# Altium schematic sheet Sheet1.SchDoc
size A3
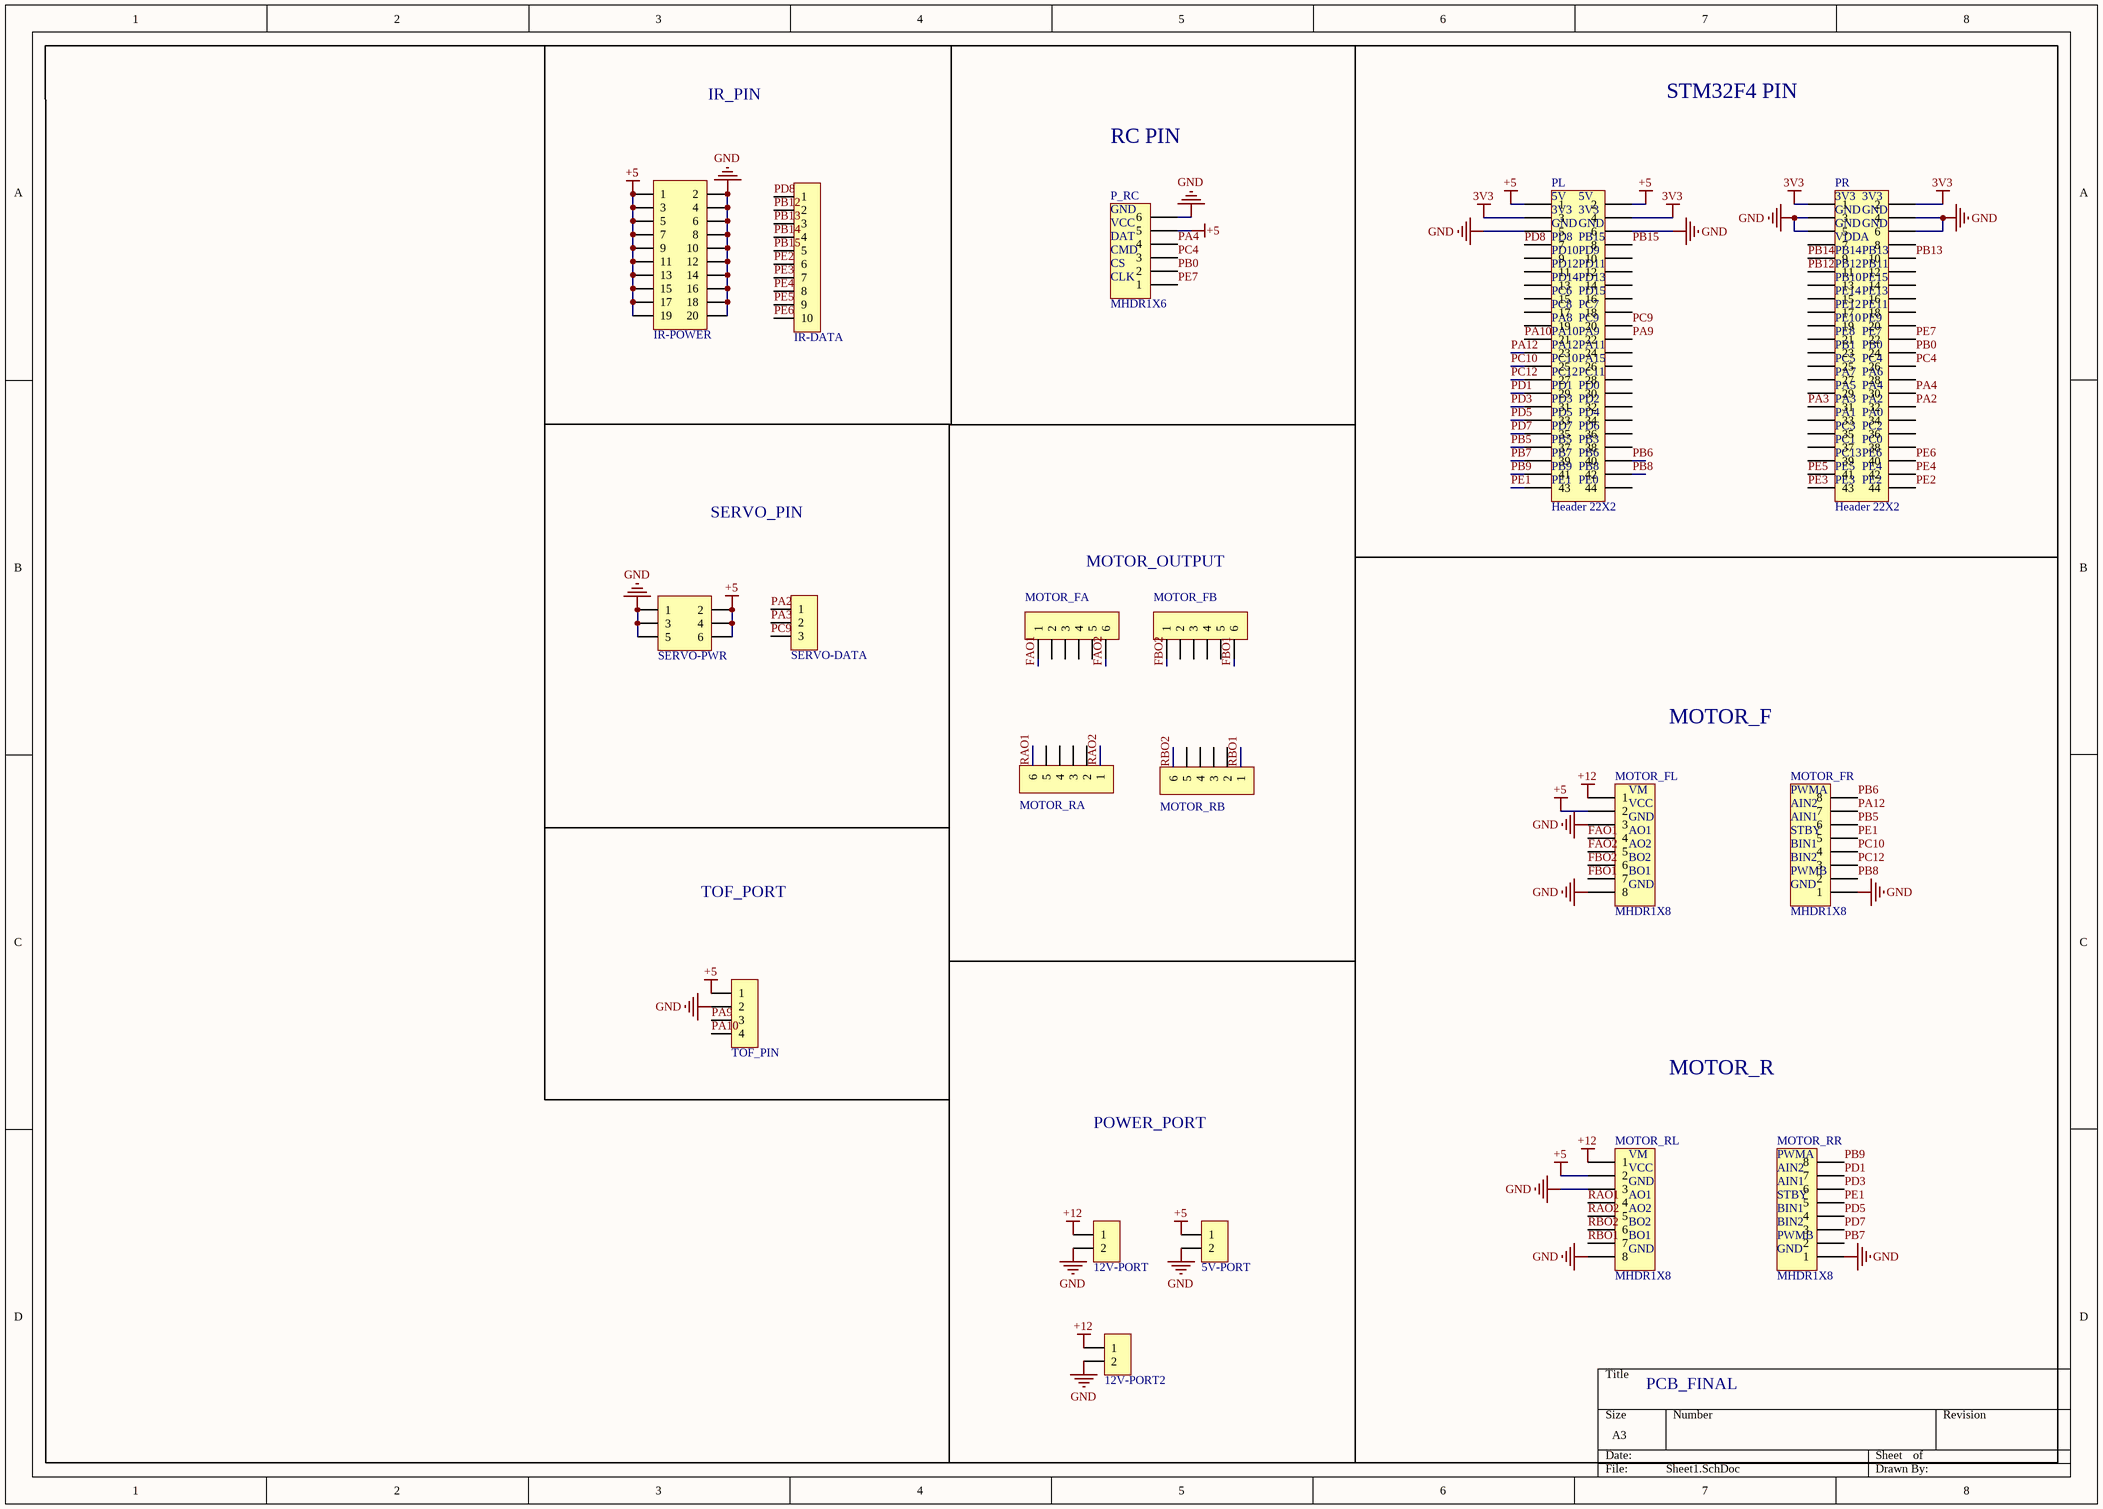
[diagram p0: Sheet1.SchDoc]

## Parts
5V-PORT  HDR-1X2  [KF301-5.0-2P]  (value not drawn)
12V-PORT  HDR-1X2  [KF301-5.0-2P]  (value not drawn)
12V-PORT2  HDR-1X2  [KF301-5.0-2P]  (value not drawn)
IR-DATA  HDR-1X10  [HDR2.54-LI-10P]  (value not drawn)
IR-POWER  Header 2X10  [HDR2.54-LI-2x10P]  (value not drawn)
MOTOR_FA  HDR-1X6  [PH2.0-LI-6P]  (value not drawn)
MOTOR_FB  HDR-1X6  [PH2.0-LI-6P]  (value not drawn)
MOTOR_FL  MHDR1X8  [HDR2.54-M-LI-8P]
MOTOR_FR  MHDR1X8  [HDR2.54-M-LI-8P]
MOTOR_RA  HDR-1X6  [PH2.0-LI-6P]  (value not drawn)
MOTOR_RB  HDR-1X6  [PH2.0-LI-6P]  (value not drawn)
MOTOR_RL  MHDR1X8  [HDR2.54-M-LI-8P]
MOTOR_RR  MHDR1X8  [HDR2.54-M-LI-8P]
P_RC  MHDR1X6  [HDR2.54-M-LI-6P]
PL  Header 22X2  [P_M_2x22P]
PR  Header 22X2  [P_M_2x22P]
SERVO-DATA  HDR-1X3  [HDR2.54-LI-3P]  (value not drawn)
SERVO-PWR  Header3X2  [HDR2.54-LI-2x3P]  (value not drawn)
TOF_PIN  HDR-1X4  [HDR2.54-LI-4P]  (value not drawn)

## Nets
3V3: PL.3 PL.4 PR.1 PR.2
+5: 5V-PORT.1 IR-POWER.1 IR-POWER.3 IR-POWER.5 IR-POWER.7 IR-POWER.9 IR-POWER.11 IR-POWER.13 IR-POWER.15 IR-POWER.17 IR-POWER.19 MOTOR_FL.2 MOTOR_RL.2 P_RC.5 PL.1 PL.2 SERVO-PWR.2 SERVO-PWR.4 SERVO-PWR.6 TOF_PIN.1
+12: 12V-PORT.1 12V-PORT2.1 MOTOR_FL.1 MOTOR_RL.1
GND: 5V-PORT.2 12V-PORT.2 12V-PORT2.2 IR-POWER.2 IR-POWER.4 IR-POWER.6 IR-POWER.8 IR-POWER.10 IR-POWER.12 IR-POWER.14 IR-POWER.16 IR-POWER.18 IR-POWER.20 MOTOR_FL.3 MOTOR_FL.8 MOTOR_FR.1 MOTOR_RL.3 MOTOR_RL.8 MOTOR_RR.1 P_RC.6 PL.5 PL.6 PR.3 PR.4 PR.5 PR.6 SERVO-PWR.1 SERVO-PWR.3 SERVO-PWR.5 TOF_PIN.2
FAO1: MOTOR_FA.1 MOTOR_FL.4
FAO2: MOTOR_FA.6 MOTOR_FL.5
FBO1: MOTOR_FB.6 MOTOR_FL.7
FBO2: MOTOR_FB.1 MOTOR_FL.6
PA2: PR.32 SERVO-DATA.1
PA3: PR.31 SERVO-DATA.2
PA4: P_RC.4 PR.30
PA9: PL.22 TOF_PIN.3
PA10: PL.21 TOF_PIN.4
PA12: MOTOR_FR.7 PL.23
PB0: P_RC.2 PR.24
PB5: MOTOR_FR.6 PL.37
PB6: MOTOR_FR.8 PL.40
PB7: MOTOR_RR.2 PL.39
PB8: MOTOR_FR.2 PL.42
PB9: MOTOR_RR.8 PL.41
PB12: IR-DATA.2 PR.11
PB13: IR-DATA.3 PR.10
PB14: IR-DATA.4 PR.9
PB15: IR-DATA.5 PL.8
PC4: P_RC.3 PR.26
PC9: PL.20 SERVO-DATA.3
PC10: MOTOR_FR.4 PL.25
PC12: MOTOR_FR.3 PL.27
PD1: MOTOR_RR.7 PL.29
PD3: MOTOR_RR.6 PL.31
PD5: MOTOR_RR.4 PL.33
PD7: MOTOR_RR.3 PL.35
PD8: IR-DATA.1 PL.7
PE1: MOTOR_FR.5 MOTOR_RR.5 PL.43
PE2: IR-DATA.6 PR.44
PE3: IR-DATA.7 PR.43
PE4: IR-DATA.8 PR.42
PE5: IR-DATA.9 PR.41
PE6: IR-DATA.10 PR.40
PE7: P_RC.1 PR.22
RAO1: MOTOR_RA.6 MOTOR_RL.4
RAO2: MOTOR_RA.1 MOTOR_RL.5
RBO1: MOTOR_RB.1 MOTOR_RL.7
RBO2: MOTOR_RB.6 MOTOR_RL.6

Not connected (* = marked no-connect by the designer): MOTOR_FA 2 3 4 5; MOTOR_FB 2 3 4 5; MOTOR_RA 2 3 4 5; MOTOR_RB 2 3 4 5; PL 9 10 11 12 13 14 15 16 17 18 19 24 26 28 30 32 34 36 38 44; PR 7 8 12 13 14 15 16 17 18 19 20 21 23 25 27 28 29 33 34 35 36 37 38 39

## Notes on the sheet
- IR_PIN
- STM32F4 PIN
- RC PIN
- (near P_RC) GND
- (near P_RC) VCC
- (near P_RC) DAT
- (near PL) 5V
- (near PL) 3V3
- (near PL) GND
- (near PL) PD8
- (near PL) PB15
- (near PR) VDDA
- (near PR) GND
- (near PR) 3V3
- (near P_RC) CMD
- (near P_RC) CS
- (near P_RC) CLK
- (near PL) PD10
- (near PL) PD12
- (near PL) PD14
- (near PL) PC6
- (near PL) PC8
- (near PL) PD9
- (near PL) PD11
- (near PL) PD13
- (near PL) PD15
- (near PL) PC7
- (near PR) PB10
- (near PR) PB12
- (near PR) PB14
- (near PR) PE12
- (near PR) PE14
- (near PR) PB11
- (near PR) PB13
- (near PR) PE11
- (near PR) PE13
- (near PR) PE15
- (near PL) PC10
- (near PL) PC12
- (near PL) PA8
- (near PL) PA10
- (near PL) PA12
- (near PL) PC9
- (near PL) PC11
- (near PL) PA9
- (near PL) PA11
- (near PL) PA15
- (near PR) PC5
- (near PR) PA7
- (near PR) PB1
- (near PR) PE8
- (near PR) PE10
- (near PR) PA6
- (near PR) PB0
- (near PR) PE7
- (near PR) PE9
- (near PR) PC4
- (near PL) PD1
- (near PL) PD3
- (near PL) PD5
- (near PL) PD7
- (near PL) PB5
- (near PL) PD0
- (near PL) PD2
- (near PL) PD4
- (near PL) PD6
- (near PL) PB3
- (near PR) PC1
- (near PR) PC3
- (near PR) PA1
- (near PR) PA3
- (near PR) PA5
- (near PR) PC0
- (near PR) PC2
- (near PR) PA0
- (near PR) PA2
- (near PR) PA4
- SERVO_PIN
- (near PL) PB7
- (near PL) PB9
- (near PL) PE1
- (near PL) PB6
- (near PL) PB8
- (near PL) PE0
- (near PR) PC13
- (near PR) PE3
- (near PR) PE5
- (near PR) PE2
- (near PR) PE4
- (near PR) PE6
- MOTOR_OUTPUT
- MOTOR_F
- (near MOTOR_FL) VM
- (near MOTOR_FL) VCC
- (near MOTOR_FL) GND
- (near MOTOR_FL) AO1
- (near MOTOR_FL) AO2
- (near MOTOR_FR) PWMA
- (near MOTOR_FR) AIN1
- (near MOTOR_FR) AIN2
- (near MOTOR_FR) STBY
- (near MOTOR_FR) BIN1
- TOF_PORT
- (near MOTOR_FL) BO1
- (near MOTOR_FL) BO2
- (near MOTOR_FR) GND
- (near MOTOR_FR) BIN2
- (near MOTOR_FR) PWMB
- MOTOR_R
- POWER_PORT
- (near MOTOR_RL) GND
- (near MOTOR_RL) VM
- (near MOTOR_RL) VCC
- (near MOTOR_RR) PWMA
- (near MOTOR_RR) AIN1
- (near MOTOR_RR) AIN2
- (near MOTOR_RL) AO1
- (near MOTOR_RL) AO2
- (near MOTOR_RL) BO1
- (near MOTOR_RL) BO2
- (near MOTOR_RR) GND
- (near MOTOR_RR) STBY
- (near MOTOR_RR) BIN1
- (near MOTOR_RR) BIN2
- (near MOTOR_RR) PWMB
- PCB_FINAL

## Library data of the parts
5V-PORT 12V-PORT 12V-PORT2 = Header 2: 2P接插件; 版权归属: 封装库来自淘宝卖家 ID：黄晶宝石; BOM名称: 2P接插件; 学习资源: https://shop463601444.taobao.com
IR-DATA = Header 10: 10P接插件; 版权归属: 淘宝ID:黄晶宝石; BOM名称: 10P接插件; 学习资源: https://shop463601444.taobao.com
IR-POWER = Header 10X2: 10*2P接插件; 版权归属: 源创客; BOM名称: 10*2P接插件; 学习资源: www.ooocke.com
MOTOR_FA MOTOR_FB MOTOR_RA MOTOR_RB = Header 6: 6P接插件; 封装库来自淘宝卖家 ID：黄晶宝石: https://shop463601444.taobao.com
MOTOR_FL MOTOR_FR MOTOR_RL MOTOR_RR = MHDR1X8: Header, 8-Pin; LatestRevisionDate: 17-Jul-2002; LatestRevisionNote: Re-released for DXP Platform.; Publisher: Altium Limited
P_RC = MHDR1X6: Header, 6-Pin; LatestRevisionDate: 17-Jul-2002; LatestRevisionNote: Re-released for DXP Platform.; Publisher: Altium Limited
PL PR = Header 22X2: Header, 22-Pin, Dual row; LatestRevisionDate: 17-Jul-2002; LatestRevisionNote: Re-released for DXP Platform.; Publisher: Altium Limited
SERVO-DATA = Header 3: 3P接插件; 版权归属: 封装库来自淘宝 ID：黄晶宝石; BOM名称: 3P接插件; 学习资源: https://shop463601444.taobao.com
SERVO-PWR = Header 3X2: 3*2P接插件; 版权归属: 封装库来自淘宝 ID：黄晶宝石; BOM名称: 3*2P接插件; 学习资源: https://shop463601444.taobao.com
TOF_PIN = Header 4: 4P接插件; 版权归属: 封装库来自淘宝 ID：黄晶宝石; BOM名称: 4P接插件; 学习资源: https://shop463601444.taobao.com